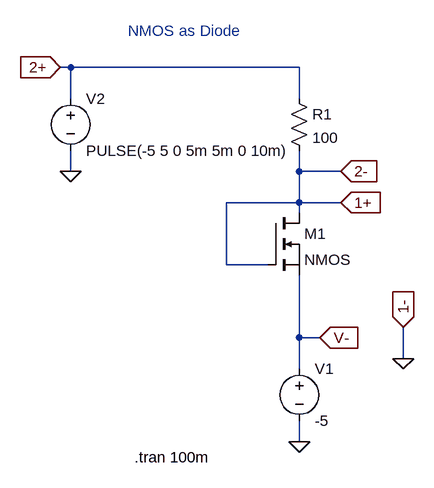
[diagram p0: schematic nmos_diode_ltspice.asc]
nmos_diode_ltspice.asc, the LTspice schematic file:
Version 4
SHEET 1 880 680
WIRE -144 -96 -160 -96
WIRE 208 -96 -144 -96
WIRE -144 -48 -144 -96
WIRE 208 -48 208 -96
WIRE -144 64 -144 32
WIRE 208 64 208 32
WIRE 272 64 208 64
WIRE 208 112 208 64
WIRE 208 112 96 112
WIRE 272 112 208 112
WIRE 208 128 208 112
WIRE 96 208 96 112
WIRE 160 208 96 208
WIRE 208 320 208 224
WIRE 240 320 208 320
WIRE 368 352 368 304
WIRE 208 368 208 320
WIRE 208 480 208 448
FLAG 208 480 0
FLAG 240 320 V-
IOPIN 240 320 In
FLAG 368 352 0
FLAG 368 304 1-
IOPIN 368 304 In
FLAG 272 64 2-
IOPIN 272 64 In
FLAG 272 112 1+
IOPIN 272 112 In
FLAG -144 64 0
FLAG -160 -96 2+
IOPIN -160 -96 In
SYMBOL nmos 160 128 R0
SYMATTR InstName M1
SYMBOL res 192 -64 R0
SYMATTR InstName R1
SYMATTR Value 100
SYMBOL voltage 208 352 R0
WINDOW 123 0 0 Left 0
WINDOW 39 0 0 Left 0
SYMATTR InstName V1
SYMATTR Value -5
SYMBOL voltage -144 -64 R0
WINDOW 123 0 0 Left 0
WINDOW 39 0 0 Left 0
SYMATTR InstName V2
SYMATTR Value PULSE(-5 5 0 5m 5m 0 10m)
TEXT -46 504 Left 2 !.tran 100m
TEXT -56 -152 Left 2 ;NMOS as Diode

The netlist it stands for:
* nmos_diode_ltspice.asc
M1 1+ 1+ V- V- NMOS
R1 2+ 1+ 100
V1 V- 0 -5
V2 2+ 0 PULSE(-5 5 0 5m 5m 0 10m)
.model NMOS NMOS
.model PMOS PMOS
.lib standard.mos
.tran 100m
* NMOS as Diode
.backanno
.end